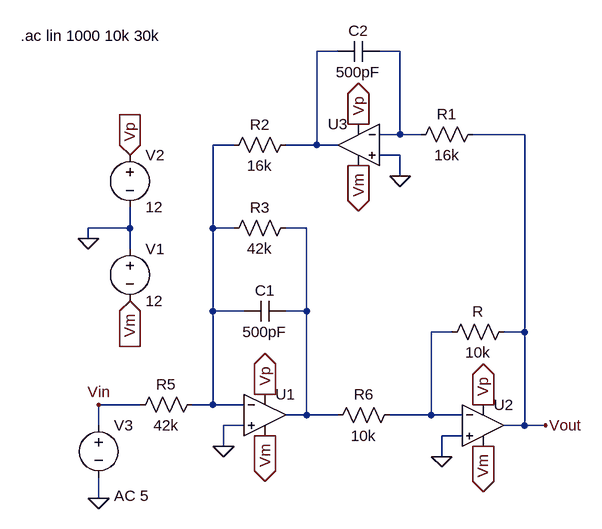
[diagram p0: schematic Biquad-Active-Filter.asc]
Biquad-Active-Filter.asc, the LTspice schematic file:
Version 4
SHEET 1 916 680
WIRE -192 -224 -224 -224
WIRE -96 -224 -128 -224
WIRE -96 -96 -96 -224
WIRE -96 -96 -128 -96
WIRE -64 -96 -96 -96
WIRE 96 -96 16 -96
WIRE -352 -80 -384 -80
WIRE -224 -80 -224 -224
WIRE -224 -80 -272 -80
WIRE -192 -80 -224 -80
WIRE -96 -64 -128 -64
WIRE -96 -32 -96 -64
WIRE -512 48 -512 16
WIRE -512 48 -576 48
WIRE -384 48 -384 -80
WIRE -352 48 -384 48
WIRE -240 48 -272 48
WIRE -576 64 -576 48
WIRE -512 80 -512 48
WIRE -384 176 -384 48
WIRE -336 176 -384 176
WIRE -240 176 -240 48
WIRE -240 176 -272 176
WIRE -16 208 -48 208
WIRE 96 208 96 -96
WIRE 96 208 64 208
WIRE -496 320 -560 320
WIRE -384 320 -384 176
WIRE -384 320 -416 320
WIRE -336 320 -384 320
WIRE -240 336 -240 176
WIRE -240 336 -272 336
WIRE -192 336 -240 336
WIRE -48 336 -48 208
WIRE -48 336 -112 336
WIRE 0 336 -48 336
WIRE -560 352 -560 320
WIRE -336 352 -368 352
WIRE 96 352 96 208
WIRE 96 352 64 352
WIRE 128 352 96 352
WIRE 0 368 -32 368
WIRE -368 384 -368 352
WIRE -32 400 -32 368
WIRE -560 464 -560 432
FLAG -576 64 0
FLAG -512 -64 Vp
IOPIN -512 -64 In
FLAG -512 160 Vm
IOPIN -512 160 In
FLAG -368 384 0
FLAG -32 400 0
FLAG 32 320 Vp
IOPIN 32 320 Out
FLAG -160 -112 Vp
IOPIN -160 -112 Out
FLAG -304 304 Vp
IOPIN -304 304 Out
FLAG -304 368 Vm
IOPIN -304 368 Out
FLAG 32 384 Vm
IOPIN 32 384 Out
FLAG -160 -48 Vm
IOPIN -160 -48 Out
FLAG -560 464 0
FLAG 128 352 Vout
FLAG -560 320 Vin
FLAG -96 -32 0
SYMBOL voltage -512 64 R0
WINDOW 123 0 0 Left 0
WINDOW 39 0 0 Left 0
SYMATTR InstName V1
SYMATTR Value 12
SYMBOL voltage -512 -80 R0
WINDOW 123 0 0 Left 0
WINDOW 39 0 0 Left 0
SYMATTR InstName V2
SYMATTR Value 12
SYMBOL OpAmps\\UniversalOpAmp -304 336 R0
SYMATTR InstName U1
SYMBOL OpAmps\\UniversalOpAmp 32 352 R0
SYMATTR InstName U2
SYMBOL OpAmps\\UniversalOpAmp -160 -80 M0
SYMATTR InstName U3
SYMBOL cap -272 160 R90
WINDOW 0 0 32 VBottom 2
WINDOW 3 32 32 VTop 2
SYMATTR InstName C1
SYMATTR Value 500pF
SYMBOL res -256 32 R90
WINDOW 0 0 56 VBottom 2
WINDOW 3 32 56 VTop 2
SYMATTR InstName R3
SYMATTR Value 42k
SYMBOL res -400 304 R90
WINDOW 0 0 56 VBottom 2
WINDOW 3 32 56 VTop 2
SYMATTR InstName R5
SYMATTR Value 42k
SYMBOL res -96 320 R90
WINDOW 0 0 56 VBottom 2
WINDOW 3 32 56 VTop 2
SYMATTR InstName R6
SYMATTR Value 10k
SYMBOL res 80 192 R90
WINDOW 0 0 56 VBottom 2
WINDOW 3 32 56 VTop 2
SYMATTR InstName R
SYMATTR Value 10k
SYMBOL res 32 -112 R90
WINDOW 0 0 56 VBottom 2
WINDOW 3 32 56 VTop 2
SYMATTR InstName R1
SYMATTR Value 16k
SYMBOL cap -128 -240 R90
WINDOW 0 0 32 VBottom 2
WINDOW 3 32 32 VTop 2
SYMATTR InstName C2
SYMATTR Value 500pF
SYMBOL res -256 -96 R90
WINDOW 0 0 56 VBottom 2
WINDOW 3 32 56 VTop 2
SYMATTR InstName R2
SYMATTR Value 16k
SYMBOL voltage -560 336 R0
WINDOW 123 24 124 Left 2
WINDOW 39 0 0 Left 0
SYMATTR InstName V3
SYMATTR Value ""
SYMATTR Value2 AC 5
TEXT -680 -248 Left 2 !.ac lin 1000 10k 30k

The netlist it stands for:
* Biquad-Active-Filter.asc
V1 0 Vm 12
V2 Vp 0 12
XU1 0 N003 Vp Vm N004 level1 Avol=1Meg GBW=10Meg Vos=0 En=0 Enk=0 In=0 Ink=0 Rin=500Meg  ; pins In+ In- V+ V- OUT
XU2 0 N005 Vp Vm Vout level1 Avol=1Meg GBW=10Meg Vos=0 En=0 Enk=0 In=0 Ink=0 Rin=500Meg  ; pins In+ In- V+ V- OUT
XU3 0 N002 Vp Vm N001 level1 Avol=1Meg GBW=10Meg Vos=0 En=0 Enk=0 In=0 Ink=0 Rin=500Meg  ; pins In+ In- V+ V- OUT
C1 N004 N003 500pF
R3 N004 N003 42k
R5 N003 Vin 42k
R6 N005 N004 10k
R Vout N005 10k
R1 Vout N002 16k
C2 N002 N001 500pF
R2 N001 N003 16k
V3 Vin 0 AC 5
.ac lin 1000 10k 30k
.lib UniversalOpAmp1.lib
.backanno
.end